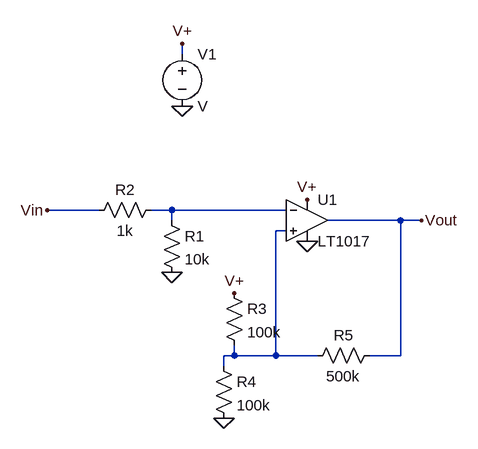
[diagram p0: schematic 08H-01.asc]
08H-01.asc, the LTspice schematic file:
Version 4.1
SHEET 1 880 680
WIRE 32 -80 32 -96
WIRE -96 160 -176 160
WIRE 16 160 -16 160
WIRE 192 160 16 160
WIRE 16 176 16 160
WIRE 368 176 256 176
WIRE 400 176 368 176
WIRE 192 192 176 192
WIRE 112 384 112 368
WIRE 112 384 96 384
WIRE 176 384 176 192
WIRE 176 384 112 384
WIRE 240 384 176 384
WIRE 368 384 368 176
WIRE 368 384 320 384
WIRE 96 400 96 384
FLAG 32 0 0
FLAG 32 -96 V+
FLAG 224 144 V+
FLAG 224 208 0
FLAG 16 256 0
FLAG 96 480 0
FLAG 112 288 V+
FLAG -176 160 Vin
FLAG 400 176 Vout
SYMBOL Comparators\\LT1017 224 176 R0
SYMATTR InstName U1
SYMBOL res 0 160 R0
SYMATTR InstName R1
SYMATTR Value 10k
SYMBOL res 0 144 R90
WINDOW 0 0 56 VBottom 2
WINDOW 3 32 56 VTop 2
SYMATTR InstName R2
SYMATTR Value 1k
SYMBOL res 96 272 R0
SYMATTR InstName R3
SYMATTR Value 100k
SYMBOL res 80 384 R0
SYMATTR InstName R4
SYMATTR Value 100k
SYMBOL res 336 368 R90
WINDOW 0 0 56 VBottom 2
WINDOW 3 32 56 VTop 2
SYMATTR InstName R5
SYMATTR Value 500k
SYMBOL voltage 32 -96 R0
SYMATTR InstName V1

The netlist it stands for:
* 08H-01.asc
X§U1 N002 N001 V+ 0 Vout LT1017  ; pins In+ In- V+ V- OUT
R1 N001 0 10k
R2 N001 Vin 1k
R3 V+ N002 100k
R4 N002 0 100k
R5 Vout N002 500k
V1 V+ 0 V
.backanno
.end